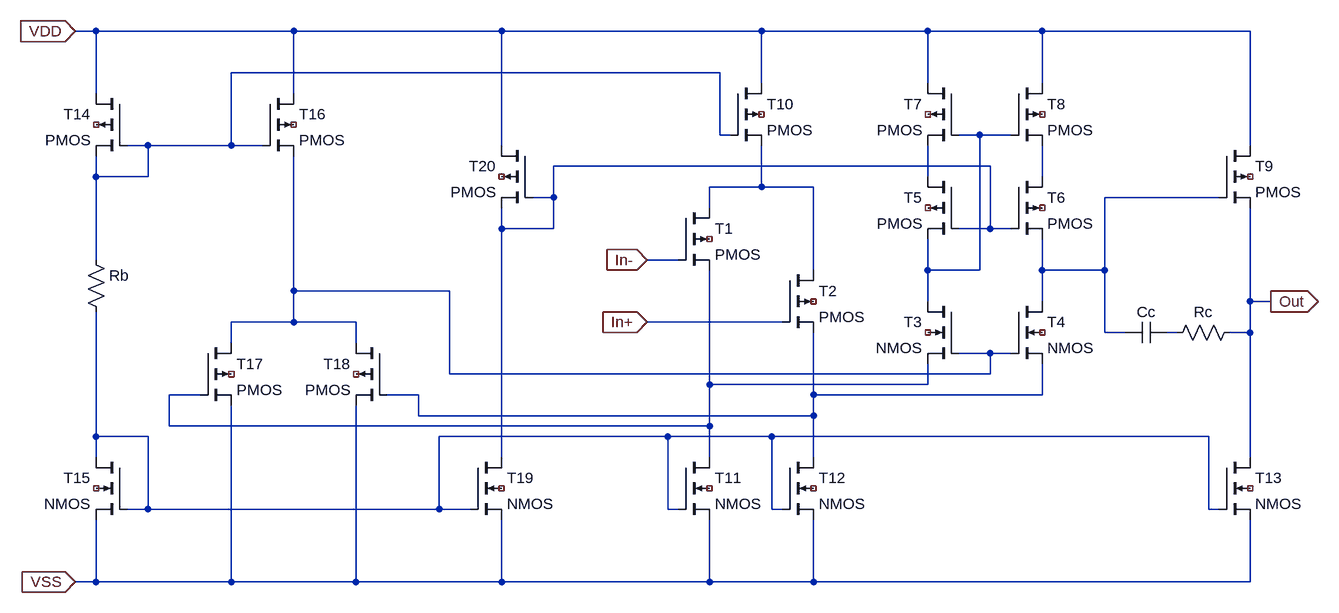
[diagram p0: schematic amplifier.asc]
amplifier.asc, the LTspice schematic file:
Version 4
SHEET 1 1076 680
WIRE -832 -336 -864 -336
WIRE -528 -336 -832 -336
WIRE -208 -336 -528 -336
WIRE 192 -336 -208 -336
WIRE 448 -336 192 -336
WIRE 624 -336 448 -336
WIRE 944 -336 624 -336
WIRE 128 -272 -624 -272
WIRE 192 -256 192 -336
WIRE 448 -256 448 -336
WIRE 624 -256 624 -336
WIRE -832 -240 -832 -336
WIRE -528 -240 -528 -336
WIRE 128 -176 128 -272
WIRE 144 -176 128 -176
WIRE 528 -176 496 -176
WIRE 576 -176 528 -176
WIRE -752 -160 -784 -160
WIRE -624 -160 -624 -272
WIRE -624 -160 -752 -160
WIRE -576 -160 -624 -160
WIRE -208 -160 -208 -336
WIRE 944 -160 944 -336
WIRE 544 -128 -128 -128
WIRE -832 -112 -832 -144
WIRE -752 -112 -752 -160
WIRE -752 -112 -832 -112
WIRE 448 -112 448 -160
WIRE 624 -112 624 -160
WIRE 192 -96 192 -160
WIRE 192 -96 112 -96
WIRE 272 -96 192 -96
WIRE -128 -80 -128 -128
WIRE -128 -80 -160 -80
WIRE 896 -80 720 -80
WIRE 112 -64 112 -96
WIRE -208 -32 -208 -64
WIRE -128 -32 -128 -80
WIRE -128 -32 -208 -32
WIRE 544 -32 544 -128
WIRE 544 -32 496 -32
WIRE 576 -32 544 -32
WIRE -832 16 -832 -112
WIRE 64 16 16 16
WIRE 272 32 272 -96
WIRE 448 32 448 -16
WIRE 528 32 528 -176
WIRE 528 32 448 32
WIRE 624 32 624 -16
WIRE 720 32 720 -80
WIRE 720 32 624 32
WIRE -528 64 -528 -144
WIRE -288 64 -528 64
WIRE 448 80 448 32
WIRE 624 80 624 32
WIRE 944 80 944 -64
WIRE 976 80 944 80
WIRE -528 112 -528 64
WIRE -528 112 -624 112
WIRE -432 112 -528 112
WIRE 224 112 16 112
WIRE 720 128 720 32
WIRE 752 128 720 128
WIRE 832 128 816 128
WIRE 944 128 944 80
WIRE 944 128 912 128
WIRE -624 144 -624 112
WIRE -432 144 -432 112
WIRE 544 160 496 160
WIRE 576 160 544 160
WIRE -288 192 -288 64
WIRE 544 192 544 160
WIRE 544 192 -288 192
WIRE 112 208 112 32
WIRE 448 208 448 176
WIRE 448 208 112 208
WIRE -672 224 -720 224
WIRE -336 224 -384 224
WIRE 272 224 272 128
WIRE 624 224 624 176
WIRE 624 224 272 224
WIRE -336 256 -336 224
WIRE 272 256 272 224
WIRE 272 256 -336 256
WIRE -720 272 -720 224
WIRE 112 272 112 208
WIRE 112 272 -720 272
WIRE -832 288 -832 96
WIRE -752 288 -832 288
WIRE 48 288 -304 288
WIRE 208 288 48 288
WIRE 880 288 208 288
WIRE -832 320 -832 288
WIRE -208 320 -208 -32
WIRE 112 320 112 272
WIRE 272 320 272 256
WIRE 944 320 944 128
WIRE -752 400 -752 288
WIRE -752 400 -784 400
WIRE -304 400 -304 288
WIRE -304 400 -752 400
WIRE -256 400 -304 400
WIRE 48 400 48 288
WIRE 64 400 48 400
WIRE 208 400 208 288
WIRE 224 400 208 400
WIRE 880 400 880 288
WIRE 896 400 880 400
WIRE -832 512 -832 416
WIRE -832 512 -864 512
WIRE -624 512 -624 240
WIRE -624 512 -832 512
WIRE -432 512 -432 240
WIRE -432 512 -624 512
WIRE -208 512 -208 416
WIRE -208 512 -432 512
WIRE 112 512 112 416
WIRE 112 512 -208 512
WIRE 272 512 272 416
WIRE 272 512 112 512
WIRE 944 512 944 416
WIRE 944 512 272 512
FLAG -864 -336 VDD
IOPIN -864 -336 In
FLAG -864 512 VSS
IOPIN -864 512 In
FLAG 16 112 In+
IOPIN 16 112 In
FLAG 16 16 In-
IOPIN 16 16 In
FLAG 976 80 Out
IOPIN 976 80 Out
SYMBOL nmos4 576 80 R0
SYMATTR InstName T4
SYMBOL nmos4 496 80 M0
SYMATTR InstName T3
SYMBOL nmos4 896 320 R0
SYMATTR InstName T13
SYMBOL nmos4 -256 320 R0
SYMATTR InstName T19
SYMBOL nmos4 224 320 R0
SYMATTR InstName T12
SYMBOL nmos4 -784 320 M0
SYMATTR InstName T15
SYMBOL pmos4 144 -256 R0
SYMATTR InstName T10
SYMBOL pmos4 64 -64 R0
SYMATTR InstName T1
SYMBOL pmos4 224 32 R0
SYMATTR InstName T2
SYMBOL pmos4 496 -256 M0
SYMATTR InstName T7
SYMBOL pmos4 496 -112 M0
SYMATTR InstName T5
SYMBOL pmos4 576 -256 R0
SYMATTR InstName T8
SYMBOL pmos4 576 -112 R0
SYMATTR InstName T6
SYMBOL pmos4 896 -160 R0
SYMATTR InstName T9
SYMBOL pmos4 -576 -240 R0
SYMATTR InstName T16
SYMBOL pmos4 -672 144 R0
SYMATTR InstName T17
SYMBOL pmos4 -384 144 M0
SYMATTR InstName T18
SYMBOL pmos4 -160 -160 M0
SYMATTR InstName T20
SYMBOL pmos4 -784 -240 M0
SYMATTR InstName T14
SYMBOL res -848 0 R0
SYMATTR InstName Rb
SYMATTR Value ""
SYMBOL res 928 112 R90
WINDOW 0 0 56 VBottom 2
WINDOW 3 32 56 VTop 2
SYMATTR InstName Rc
SYMATTR Value ""
SYMBOL cap 816 112 R90
WINDOW 0 0 32 VBottom 2
WINDOW 3 32 32 VTop 2
SYMATTR InstName Cc
SYMATTR Value ""
SYMBOL nmos4 64 320 R0
SYMATTR InstName T11

The netlist it stands for:
* amplifier.asc
M§T4 N007 N008 N011 NC_01 NMOS
M§T3 N002 N008 N010 NC_02 NMOS
M§T13 Out N012 VSS NC_03 NMOS
M§T19 N003 N012 VSS NC_04 NMOS
M§T12 N011 N012 VSS NC_05 NMOS
M§T15 N012 N012 VSS NC_06 NMOS
M§T10 VDD N001 N006 NC_07 PMOS
M§T1 N006 In- N010 NC_08 PMOS
M§T2 N006 In+ N011 NC_09 PMOS
M§T7 VDD N002 N004 NC_10 PMOS
M§T5 N004 N003 N002 NC_11 PMOS
M§T8 VDD N002 N005 NC_12 PMOS
M§T6 N005 N003 N007 NC_13 PMOS
M§T9 VDD N007 Out NC_14 PMOS
M§T16 VDD N001 N008 NC_15 PMOS
M§T17 N008 N010 VSS NC_16 PMOS
M§T18 N008 N011 VSS NC_17 PMOS
M§T20 VDD N003 N003 NC_18 PMOS
M§T14 VDD N001 N001 NC_19 PMOS
Rb N001 N012
Rc Out N009
Cc N009 N007
M§T11 N010 N012 VSS NC_20 NMOS
.model NMOS NMOS
.model PMOS PMOS
.lib standard.mos
.backanno
.end